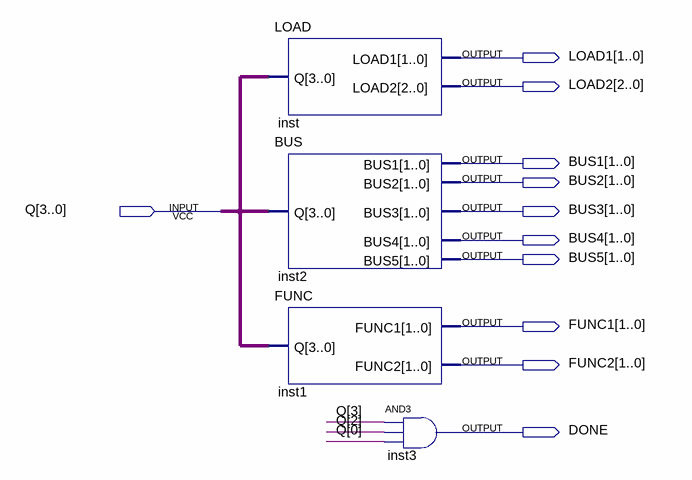
[diagram p0: schematic sheet]
// Quartus schematic OUTPUTLOGIC.bdf as structural Verilog: 4 symbols, 11 pins
module OUTPUTLOGIC (
  input  [3:0] Q,
  output [1:0] LOAD1,
  output [2:0] LOAD2,
  output [1:0] BUS1,
  output [1:0] BUS2,
  output [1:0] BUS3,
  output [1:0] BUS4,
  output [1:0] BUS5,
  output [1:0] FUNC1,
  output [1:0] FUNC2,
  output DONE
);

  LOAD inst (.Q(Q), .LOAD1(LOAD1), .LOAD2(LOAD2));
  BUS inst2 (.Q(Q), .BUS1(BUS1), .BUS2(BUS2), .BUS3(BUS3), .BUS4(BUS4), .BUS5(BUS5));
  FUNC inst1 (.Q(Q), .FUNC1(FUNC1), .FUNC2(FUNC2));
  and inst3 (DONE, Q[3], Q[2], Q[0]);
endmodule
